# Altium schematic sheet SoC_FPGA_64_65_66_DDR4.SchDoc: RFSoC AMC
size 420 x 297 mm; CompanyName: WUT; DrawnBy: T. Przywozki; Organization: WUT ISE; Address1: Warsaw University of Technology; Address2: Nowowiejska 15/19 00-665 Warsaw; Address3: Tomasz.Przywozki@pw.edu.pl; DocumentNumber: 3; Revision: 1; SheetNumber: 3; SheetTotal: 45; Project: RFSoC AMC; ModifiedBy: T. Przywozki; CreateDate: -; CheckedDate: -; DivGrp: ISE; Designer: T. Przywozki; ModifiedDate: -; ProjectName: ADC/DAC MEZZANINE
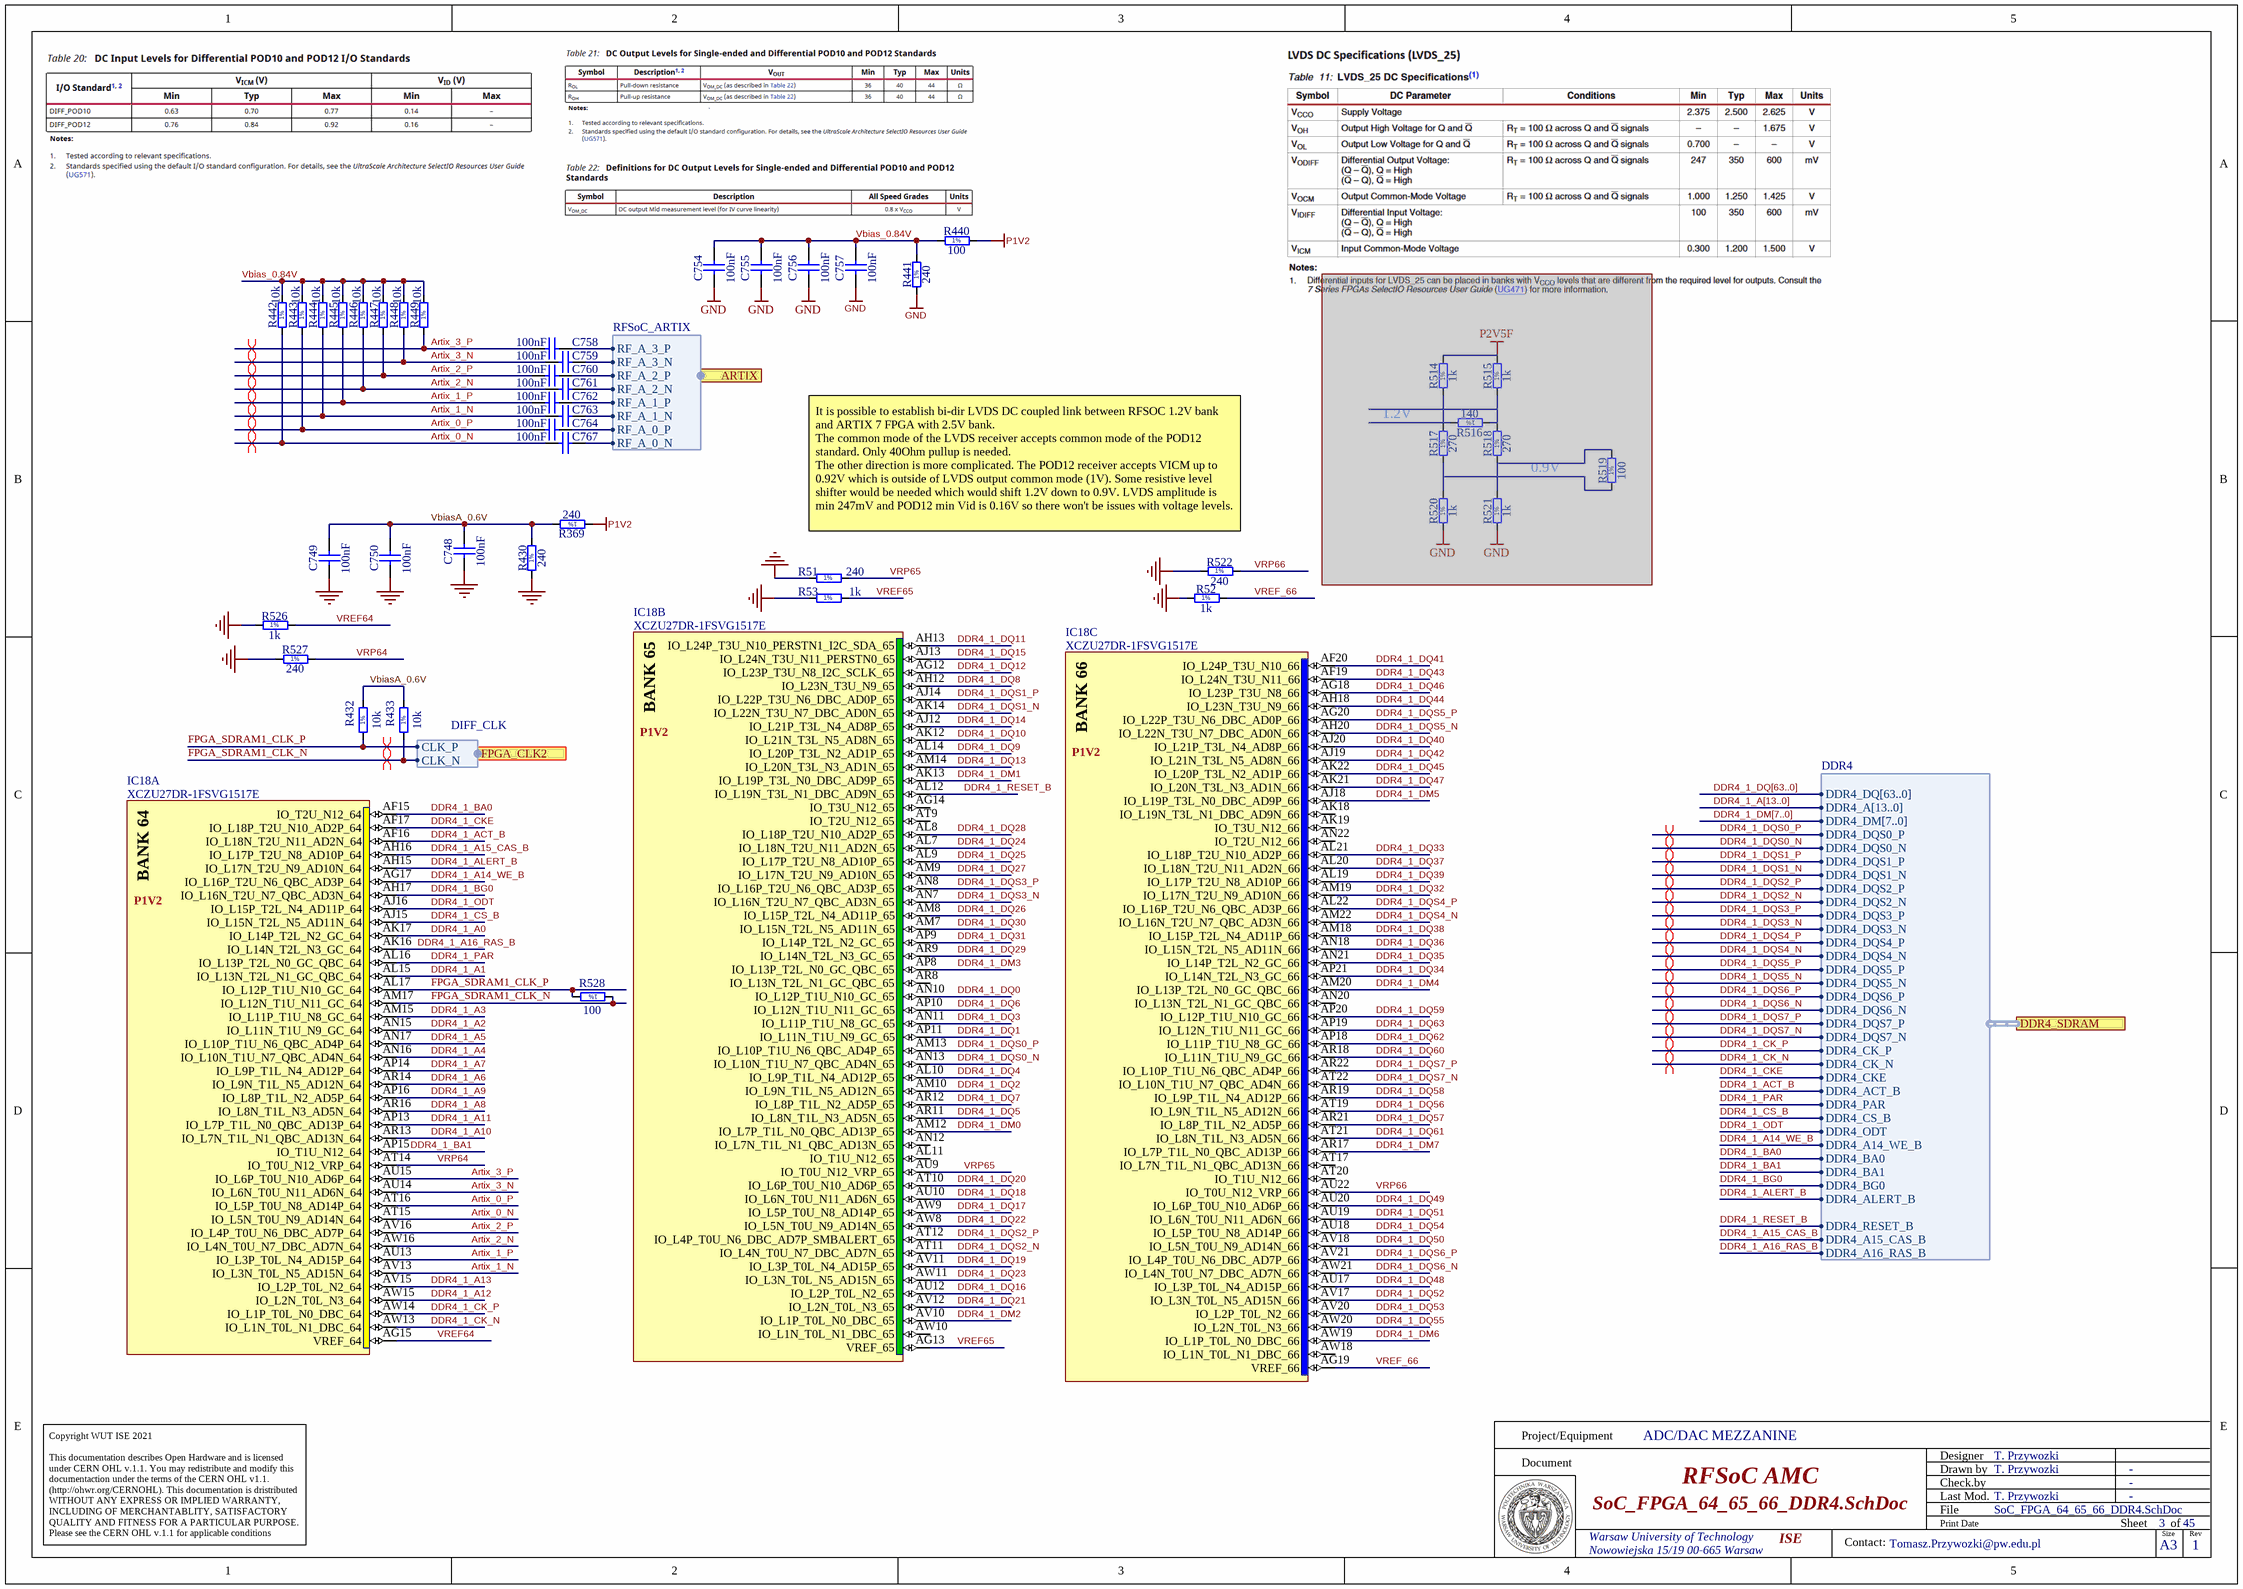
[diagram p0: SoC_FPGA_64_65_66_DDR4.SchDoc]

## Parts
C748  100nF  [CAPC0603X33N]
C749  100nF  [CAPC0603X33N]
C750  100nF  [CAPC0603X33N]
C754  100nF  [CAPC0603X33N]
C755  100nF  [CAPC0603X33N]
C756  100nF  [CAPC0603X33N]
C757  100nF  [CAPC0603X33N]
C758  100nF  [CAPC1005X55N]
C759  100nF  [CAPC1005X55N]
C760  100nF  [CAPC1005X55N]
C761  100nF  [CAPC1005X55N]
C762  100nF  [CAPC1005X55N]
C763  100nF  [CAPC1005X55N]
C764  100nF  [CAPC1005X55N]
C767  100nF  [CAPC1005X55N]
IC18  XCZU27DR-1FSVG1517E  [XILINX_FSVG1517 (XCZU27DR)]  (parts A,B,C of 31)
R51  240  [RESC1005X40N]
R52  1k  [RESC1005X40N]
R53  1k  [RESC1005X40N]
R369  240  [RESC1005X40N]
R430  240  [RESC1005X40N]
R432  10k  [RESC1005X40N]
R433  10k  [RESC1005X40N]
R440  100  [RESC0603X28N]
R441  240  [RESC1005X40N]
R442  10k  [RESC1005X40N]
R443  10k  [RESC1005X40N]
R444  10k  [RESC1005X40N]
R445  10k  [RESC1005X40N]
R446  10k  [RESC1005X40N]
R447  10k  [RESC1005X40N]
R448  10k  [RESC1005X40N]
R449  10k  [RESC1005X40N]
R514  1k  [RESC1005X40N]  (masked out: inside a compile mask, not in the netlist)
R515  1k  [RESC1005X40N]  (masked out: inside a compile mask, not in the netlist)
R516  140  [RESC1005X40N]  (masked out: inside a compile mask, not in the netlist)
R517  270  [RESC1005X40N]  (masked out: inside a compile mask, not in the netlist)
R518  270  [RESC1005X40N]  (masked out: inside a compile mask, not in the netlist)
R519  100  [RESC1005X40N]  (masked out: inside a compile mask, not in the netlist)
R520  1k  [RESC1005X40N]  (masked out: inside a compile mask, not in the netlist)
R521  1k  [RESC1005X40N]  (masked out: inside a compile mask, not in the netlist)
R522  240  [RESC1005X40N]
R526  1k  [RESC1005X40N]
R527  240  [RESC1005X40N]
R528  100  [RESC1005X40N]

## Ports
ARTIX (harness RFSoC_ARTIX), DDR4_SDRAM (harness DDR4), FPGA_CLK2 (out, harness DIFF_CLK)

## Harnesses
DDR4: DDR4_DQ[63..0], DDR4_A[13..0], DDR4_DM[7..0], DDR4_DQS0_P, DDR4_DQS0_N, DDR4_DQS1_P, DDR4_DQS1_N, DDR4_DQS2_P, DDR4_DQS2_N, DDR4_DQS3_P, DDR4_DQS3_N, DDR4_DQS4_P, DDR4_DQS4_N, DDR4_DQS5_P, DDR4_DQS5_N, DDR4_DQS6_P, DDR4_DQS6_N, DDR4_DQS7_P, DDR4_DQS7_N, DDR4_CK_P, DDR4_CK_N, DDR4_CKE, DDR4_ACT_B, DDR4_PAR, DDR4_CS_B, DDR4_ODT, DDR4_A14_WE_B, DDR4_BA0, DDR4_BA1, DDR4_BG0, DDR4_ALERT_B, DDR4_RESET_B, DDR4_A15_CAS_B, DDR4_A16_RAS_B
DIFF_CLK: CLK_P, CLK_N
RFSoC_ARTIX: RF_A_0_N, RF_A_0_P, RF_A_1_N, RF_A_1_P, RF_A_2_N, RF_A_2_P, RF_A_3_N, RF_A_3_P

## Nets
GND: C748.2 C749.2 C750.2 C754.2 C755.2 C756.2 C757.2 R51.1 R52.1 R53.1 R430.1 R441.1 R522.1 R526.1 R527.1
P1V2: R369.1 R440.2
Artix_0_N: C767.1 IC18.AT15(IO_L5N_T0U_N9_AD14N_64) R442.1
Artix_0_P: C764.1 IC18.AT16(IO_L5P_T0U_N8_AD14P_64) R443.1
Artix_1_N: C763.1 IC18.AV13(IO_L3N_T0L_N5_AD15N_64) R444.1
Artix_1_P: C762.1 IC18.AU13(IO_L3P_T0L_N4_AD15P_64) R445.1
Artix_2_N: C761.1 IC18.AW16(IO_L4N_T0U_N7_DBC_AD7N_64) R446.1
Artix_2_P: C760.1 IC18.AV16(IO_L4P_T0U_N6_DBC_AD7P_64) R447.1
Artix_3_N: C759.1 IC18.AU14(IO_L6N_T0U_N11_AD6N_64) R448.1
Artix_3_P: C758.1 IC18.AU15(IO_L6P_T0U_N10_AD6P_64) R449.1
DDR4_1_A0: IC18.AK17(IO_L14P_T2L_N2_GC_64)
DDR4_1_A1: IC18.AL15(IO_L13N_T2L_N1_GC_QBC_64)
DDR4_1_A2: IC18.AN15(IO_L11N_T1U_N9_GC_64)
DDR4_1_A3: IC18.AM15(IO_L11P_T1U_N8_GC_64)
DDR4_1_A4: IC18.AN16(IO_L10N_T1U_N7_QBC_AD4N_64)
DDR4_1_A5: IC18.AN17(IO_L10P_T1U_N6_QBC_AD4P_64)
DDR4_1_A6: IC18.AR14(IO_L9N_T1L_N5_AD12N_64)
DDR4_1_A7: IC18.AP14(IO_L9P_T1L_N4_AD12P_64)
DDR4_1_A8: IC18.AR16(IO_L8N_T1L_N3_AD5N_64)
DDR4_1_A9: IC18.AP16(IO_L8P_T1L_N2_AD5P_64)
DDR4_1_A10: IC18.AR13(IO_L7N_T1L_N1_QBC_AD13N_64)
DDR4_1_A11: IC18.AP13(IO_L7P_T1L_N0_QBC_AD13P_64)
DDR4_1_A12: IC18.AW15(IO_L2N_T0L_N3_64)
DDR4_1_A13: IC18.AV15(IO_L2P_T0L_N2_64)
DDR4_1_A14_WE_B: IC18.AG17(IO_L16P_T2U_N6_QBC_AD3P_64) ; port DDR4_SDRAM.DDR4_A14_WE_B
DDR4_1_A15_CAS_B: IC18.AH16(IO_L17P_T2U_N8_AD10P_64) ; port DDR4_SDRAM.DDR4_A15_CAS_B
DDR4_1_A16_RAS_B: IC18.AK16(IO_L14N_T2L_N3_GC_64) ; port DDR4_SDRAM.DDR4_A16_RAS_B
DDR4_1_ACT_B: IC18.AF16(IO_L18N_T2U_N11_AD2N_64) ; port DDR4_SDRAM.DDR4_ACT_B
DDR4_1_ALERT_B: IC18.AH15(IO_L17N_T2U_N9_AD10N_64) ; port DDR4_SDRAM.DDR4_ALERT_B
DDR4_1_BA0: IC18.AF15(IO_T2U_N12_64) ; port DDR4_SDRAM.DDR4_BA0
DDR4_1_BA1: IC18.AP15(IO_T1U_N12_64) ; port DDR4_SDRAM.DDR4_BA1
DDR4_1_BG0: IC18.AH17(IO_L16N_T2U_N7_QBC_AD3N_64) ; port DDR4_SDRAM.DDR4_BG0
DDR4_1_CK_N: IC18.AW13(IO_L1N_T0L_N1_DBC_64) ; port DDR4_SDRAM.DDR4_CK_N
DDR4_1_CK_P: IC18.AW14(IO_L1P_T0L_N0_DBC_64) ; port DDR4_SDRAM.DDR4_CK_P
DDR4_1_CKE: IC18.AF17(IO_L18P_T2U_N10_AD2P_64) ; port DDR4_SDRAM.DDR4_CKE
DDR4_1_CS_B: IC18.AJ15(IO_L15N_T2L_N5_AD11N_64) ; port DDR4_SDRAM.DDR4_CS_B
DDR4_1_DM0: IC18.AM12(IO_L7P_T1L_N0_QBC_AD13P_65)
DDR4_1_DM1: IC18.AK13(IO_L19P_T3L_N0_DBC_AD9P_65)
DDR4_1_DM2: IC18.AV10(IO_L1P_T0L_N0_DBC_65)
DDR4_1_DM3: IC18.AP8(IO_L13P_T2L_N0_GC_QBC_65)
DDR4_1_DM4: IC18.AM20(IO_L13P_T2L_N0_GC_QBC_66)
DDR4_1_DM5: IC18.AJ18(IO_L19P_T3L_N0_DBC_AD9P_66)
DDR4_1_DM6: IC18.AW19(IO_L1P_T0L_N0_DBC_66)
DDR4_1_DM7: IC18.AR17(IO_L7P_T1L_N0_QBC_AD13P_66)
DDR4_1_DQ0: IC18.AN10(IO_L12P_T1U_N10_GC_65)
DDR4_1_DQ1: IC18.AP11(IO_L11N_T1U_N9_GC_65)
DDR4_1_DQ2: IC18.AM10(IO_L9N_T1L_N5_AD12N_65)
DDR4_1_DQ3: IC18.AN11(IO_L11P_T1U_N8_GC_65)
DDR4_1_DQ4: IC18.AL10(IO_L9P_T1L_N4_AD12P_65)
DDR4_1_DQ5: IC18.AR11(IO_L8N_T1L_N3_AD5N_65)
DDR4_1_DQ6: IC18.AP10(IO_L12N_T1U_N11_GC_65)
DDR4_1_DQ7: IC18.AR12(IO_L8P_T1L_N2_AD5P_65)
DDR4_1_DQ8: IC18.AH12(IO_L23N_T3U_N9_65)
DDR4_1_DQ9: IC18.AL14(IO_L20P_T3L_N2_AD1P_65)
DDR4_1_DQ10: IC18.AK12(IO_L21N_T3L_N5_AD8N_65)
DDR4_1_DQ11: IC18.AH13(IO_L24P_T3U_N10_PERSTN1_I2C_SDA_65)
DDR4_1_DQ12: IC18.AG12(IO_L23P_T3U_N8_I2C_SCLK_65)
DDR4_1_DQ13: IC18.AM14(IO_L20N_T3L_N3_AD1N_65)
DDR4_1_DQ14: IC18.AJ12(IO_L21P_T3L_N4_AD8P_65)
DDR4_1_DQ15: IC18.AJ13(IO_L24N_T3U_N11_PERSTN0_65)
DDR4_1_DQ16: IC18.AU12(IO_L2P_T0L_N2_65)
DDR4_1_DQ17: IC18.AW9(IO_L5P_T0U_N8_AD14P_65)
DDR4_1_DQ18: IC18.AU10(IO_L6N_T0U_N11_AD6N_65)
DDR4_1_DQ19: IC18.AV11(IO_L3P_T0L_N4_AD15P_65)
DDR4_1_DQ20: IC18.AT10(IO_L6P_T0U_N10_AD6P_65)
DDR4_1_DQ21: IC18.AV12(IO_L2N_T0L_N3_65)
DDR4_1_DQ22: IC18.AW8(IO_L5N_T0U_N9_AD14N_65)
DDR4_1_DQ23: IC18.AW11(IO_L3N_T0L_N5_AD15N_65)
DDR4_1_DQ24: IC18.AL7(IO_L18N_T2U_N11_AD2N_65)
DDR4_1_DQ25: IC18.AL9(IO_L17P_T2U_N8_AD10P_65)
DDR4_1_DQ26: IC18.AM8(IO_L15P_T2L_N4_AD11P_65)
DDR4_1_DQ27: IC18.AM9(IO_L17N_T2U_N9_AD10N_65)
DDR4_1_DQ28: IC18.AL8(IO_L18P_T2U_N10_AD2P_65)
DDR4_1_DQ29: IC18.AR9(IO_L14N_T2L_N3_GC_65)
DDR4_1_DQ30: IC18.AM7(IO_L15N_T2L_N5_AD11N_65)
DDR4_1_DQ31: IC18.AP9(IO_L14P_T2L_N2_GC_65)
DDR4_1_DQ32: IC18.AM19(IO_L17N_T2U_N9_AD10N_66)
DDR4_1_DQ33: IC18.AL21(IO_L18P_T2U_N10_AD2P_66)
DDR4_1_DQ34: IC18.AP21(IO_L14N_T2L_N3_GC_66)
DDR4_1_DQ35: IC18.AN21(IO_L14P_T2L_N2_GC_66)
DDR4_1_DQ36: IC18.AN18(IO_L15N_T2L_N5_AD11N_66)
DDR4_1_DQ37: IC18.AL20(IO_L18N_T2U_N11_AD2N_66)
DDR4_1_DQ38: IC18.AM18(IO_L15P_T2L_N4_AD11P_66)
DDR4_1_DQ39: IC18.AL19(IO_L17P_T2U_N8_AD10P_66)
DDR4_1_DQ40: IC18.AJ20(IO_L21P_T3L_N4_AD8P_66)
DDR4_1_DQ41: IC18.AF20(IO_L24P_T3U_N10_66)
DDR4_1_DQ42: IC18.AJ19(IO_L21N_T3L_N5_AD8N_66)
DDR4_1_DQ43: IC18.AF19(IO_L24N_T3U_N11_66)
DDR4_1_DQ44: IC18.AH18(IO_L23N_T3U_N9_66)
DDR4_1_DQ45: IC18.AK22(IO_L20P_T3L_N2_AD1P_66)
DDR4_1_DQ46: IC18.AG18(IO_L23P_T3U_N8_66)
DDR4_1_DQ47: IC18.AK21(IO_L20N_T3L_N3_AD1N_66)
DDR4_1_DQ48: IC18.AU17(IO_L3P_T0L_N4_AD15P_66)
DDR4_1_DQ49: IC18.AU20(IO_L6P_T0U_N10_AD6P_66)
DDR4_1_DQ50: IC18.AV18(IO_L5N_T0U_N9_AD14N_66)
DDR4_1_DQ51: IC18.AU19(IO_L6N_T0U_N11_AD6N_66)
DDR4_1_DQ52: IC18.AV17(IO_L3N_T0L_N5_AD15N_66)
DDR4_1_DQ53: IC18.AV20(IO_L2P_T0L_N2_66)
DDR4_1_DQ54: IC18.AU18(IO_L5P_T0U_N8_AD14P_66)
DDR4_1_DQ55: IC18.AW20(IO_L2N_T0L_N3_66)
DDR4_1_DQ56: IC18.AT19(IO_L9N_T1L_N5_AD12N_66)
DDR4_1_DQ57: IC18.AR21(IO_L8P_T1L_N2_AD5P_66)
DDR4_1_DQ58: IC18.AR19(IO_L9P_T1L_N4_AD12P_66)
DDR4_1_DQ59: IC18.AP20(IO_L12P_T1U_N10_GC_66)
DDR4_1_DQ60: IC18.AR18(IO_L11N_T1U_N9_GC_66)
DDR4_1_DQ61: IC18.AT21(IO_L8N_T1L_N3_AD5N_66)
DDR4_1_DQ62: IC18.AP18(IO_L11P_T1U_N8_GC_66)
DDR4_1_DQ63: IC18.AP19(IO_L12N_T1U_N11_GC_66)
DDR4_1_DQS0_N: IC18.AN13(IO_L10N_T1U_N7_QBC_AD4N_65) ; port DDR4_SDRAM.DDR4_DQS0_N
DDR4_1_DQS0_P: IC18.AM13(IO_L10P_T1U_N6_QBC_AD4P_65) ; port DDR4_SDRAM.DDR4_DQS0_P
DDR4_1_DQS1_N: IC18.AK14(IO_L22N_T3U_N7_DBC_AD0N_65) ; port DDR4_SDRAM.DDR4_DQS1_N
DDR4_1_DQS1_P: IC18.AJ14(IO_L22P_T3U_N6_DBC_AD0P_65) ; port DDR4_SDRAM.DDR4_DQS1_P
DDR4_1_DQS2_N: IC18.AT11(IO_L4N_T0U_N7_DBC_AD7N_65) ; port DDR4_SDRAM.DDR4_DQS2_N
DDR4_1_DQS2_P: IC18.AT12(IO_L4P_T0U_N6_DBC_AD7P_SMBALERT_65) ; port DDR4_SDRAM.DDR4_DQS2_P
DDR4_1_DQS3_N: IC18.AN7(IO_L16N_T2U_N7_QBC_AD3N_65) ; port DDR4_SDRAM.DDR4_DQS3_N
DDR4_1_DQS3_P: IC18.AN8(IO_L16P_T2U_N6_QBC_AD3P_65) ; port DDR4_SDRAM.DDR4_DQS3_P
DDR4_1_DQS4_N: IC18.AM22(IO_L16N_T2U_N7_QBC_AD3N_66) ; port DDR4_SDRAM.DDR4_DQS4_N
DDR4_1_DQS4_P: IC18.AL22(IO_L16P_T2U_N6_QBC_AD3P_66) ; port DDR4_SDRAM.DDR4_DQS4_P
DDR4_1_DQS5_N: IC18.AH20(IO_L22N_T3U_N7_DBC_AD0N_66) ; port DDR4_SDRAM.DDR4_DQS5_N
DDR4_1_DQS5_P: IC18.AG20(IO_L22P_T3U_N6_DBC_AD0P_66) ; port DDR4_SDRAM.DDR4_DQS5_P
DDR4_1_DQS6_N: IC18.AW21(IO_L4N_T0U_N7_DBC_AD7N_66) ; port DDR4_SDRAM.DDR4_DQS6_N
DDR4_1_DQS6_P: IC18.AV21(IO_L4P_T0U_N6_DBC_AD7P_66) ; port DDR4_SDRAM.DDR4_DQS6_P
DDR4_1_DQS7_N: IC18.AT22(IO_L10N_T1U_N7_QBC_AD4N_66) ; port DDR4_SDRAM.DDR4_DQS7_N
DDR4_1_DQS7_P: IC18.AR22(IO_L10P_T1U_N6_QBC_AD4P_66) ; port DDR4_SDRAM.DDR4_DQS7_P
DDR4_1_ODT: IC18.AJ16(IO_L15P_T2L_N4_AD11P_64) ; port DDR4_SDRAM.DDR4_ODT
DDR4_1_PAR: IC18.AL16(IO_L13P_T2L_N0_GC_QBC_64) ; port DDR4_SDRAM.DDR4_PAR
DDR4_1_RESET_B: IC18.AL12(IO_L19N_T3L_N1_DBC_AD9N_65) ; port DDR4_SDRAM.DDR4_RESET_B
FPGA_SDRAM1_CLK_N: IC18.AM17(IO_L12N_T1U_N11_GC_64) R433.1 R528.2 ; port FPGA_CLK2.CLK_N
FPGA_SDRAM1_CLK_P: IC18.AL17(IO_L12P_T1U_N10_GC_64) R432.1 R528.1 ; port FPGA_CLK2.CLK_P
Vbias_0.84V: C754.1 C755.1 C756.1 C757.1 R440.1 R441.2 R442.2 R443.2 R444.2 R445.2 R446.2 R447.2 R448.2 R449.2
VbiasA_0.6V: C748.1 C749.1 C750.1 R369.2 R430.2 R432.2 R433.2
VREF64: IC18.AG15(VREF_64) R526.2
VREF65: IC18.AG13(VREF_65) R53.2
VREF_66: IC18.AG19(VREF_66) R52.2
VRP64: IC18.AT14(IO_T0U_N12_VRP_64) R527.2
VRP65: IC18.AU9(IO_T0U_N12_VRP_65) R51.2
VRP66: IC18.AU22(IO_T0U_N12_VRP_66) R522.2
NetC758_2: C758.2 ; port ARTIX.RF_A_3_P
NetC759_2: C759.2 ; port ARTIX.RF_A_3_N
NetC760_2: C760.2 ; port ARTIX.RF_A_2_P
NetC761_2: C761.2 ; port ARTIX.RF_A_2_N
NetC762_2: C762.2 ; port ARTIX.RF_A_1_P
NetC763_2: C763.2 ; port ARTIX.RF_A_1_N
NetC764_2: C764.2 ; port ARTIX.RF_A_0_P
NetC767_2: C767.2 ; port ARTIX.RF_A_0_N

Not connected (* = marked no-connect by the designer): IC18 AG14(IO_T3U_N12_65) AK18(IO_L19N_T3L_N1_DBC_AD9N_66) AK19(IO_T3U_N12_66) AL11(IO_T1U_N12_65) AN12(IO_L7N_T1L_N1_QBC_AD13N_65) AN20(IO_L13N_T2L_N1_GC_QBC_66) AN22(IO_T2U_N12_66) AR8(IO_L13N_T2L_N1_GC_QBC_65) AT9(IO_T2U_N12_65) AT17(IO_L7N_T1L_N1_QBC_AD13N_66) AT20(IO_T1U_N12_66) AW10(IO_L1N_T0L_N1_DBC_65) AW18(IO_L1N_T0L_N1_DBC_66)

## Buses and harness runs
bus DDR4_1_A[13..0]
bus DDR4_1_DM[7..0]
bus DDR4_1_DQ[63..0]

## Layout directives
differential pair: Artix_0_N, Artix_0_P, Artix_1_N, Artix_1_P, Artix_2_N, Artix_2_P, Artix_3_N, Artix_3_P, DDR4_1_CK_N, DDR4_1_CK_P, DDR4_1_DQS0_N, DDR4_1_DQS0_P, DDR4_1_DQS1_N, DDR4_1_DQS1_P, DDR4_1_DQS2_N, DDR4_1_DQS2_P, DDR4_1_DQS3_N, DDR4_1_DQS3_P, DDR4_1_DQS4_N, DDR4_1_DQS4_P, DDR4_1_DQS5_N, DDR4_1_DQS5_P, DDR4_1_DQS6_N, DDR4_1_DQS6_P, DDR4_1_DQS7_N, DDR4_1_DQS7_P, FPGA_SDRAM1_CLK_N, FPGA_SDRAM1_CLK_P

## Notes on the sheet
- 1.2V
- It is possible to establish bi-dir LVDS DC coupled link between RFSOC 1.2V bank and ARTIX 7 FPGA with 2.5V bank.
  The common mode of the LVDS receiver accepts common mode of the POD12 standard. Only 40Ohm pullup is needed.
  The other direction is more complicated. The POD12 receiver accepts VICM up to 0.92V which is outside of LVDS output common mode (1V). Some resistive level shifter would be needed which would shift 1.2V down to 0.9V. LVDS amplitude is min 247mV and POD12 min Vid is 0.16V so there won't be issues with voltage levels.
- 0.9V
- P1V2
- Project/Equipment
- Document
- Designer
- Drawn by
- Check.by
- Copyright WUT ISE 2021
  This documentation describes Open Hardware and is licensed under CERN OHL v.1.1. You may redistribute and modify this documentaction under the terms of the CERN OHL v1.1.
  (http://ohwr.org/CERNOHL). This documentation is dristributed WITHOUT ANY EXPRESS OR IMPLIED WARRANTY, INCLUDING OF MERCHANTABLITY, SATISFACTORY QUALITY AND FITNESS FOR A PARTICULAR PURPOSE. Please see the CERN OHL v.1.1 for applicable conditions
- File
- Last Mod.
- Print Date
- Sheet
- Size
- A3
- of
- Rev
- Contact:
- (in symbol R0201_100R_1%_0.05W_200PPM) 1%
- (in symbol R0402_1K_1%_0.0625W_100PPM) 1%
- (in symbol R0402_10K_1%_0.0625W_100PPM) 1%
- (in symbol R0402_100R_1%_0.0625W_100PPM) 1%
- (in symbol R0402_140R_1%_0.0625W_100PPM) 1%
- (in symbol R0402_240R_1%_0.0625W_100PPM) 1%
- (in symbol R0402_270R_1%_0.0625W_100PPM) 1%
- (in symbol XCZU27DR-1FSVG1517E, part A) BANK 64
- (in symbol XCZU27DR-1FSVG1517E, part B) BANK 65
- (in symbol XCZU27DR-1FSVG1517E, part C) BANK 66

## Library data of the parts
C748-C750 = CC0201_100NF_6.3V_10%_X5R: Non-polarised capacitor; Manufacturer: GENERIC; Part Description: SMD Multilayer Chip Ceramic Capacitor; Manufacturer1 Part Number: 02016D104KAT2A; Tolerance: ±10%; Voltage: 6.3V; TC: X5R; Manufacturer Part Number: CC0201_100NF_6.3V_10%_X5R; Part Number: CC0201_100NF_6.3V_10%_X5R; Value: 100nF; Component Kind: Standard; Component Type: Standard; Pin Count: 2; Status: Not Recommended; Case: 0201; Mounted: Yes; Socket: No; SMD: Yes; Sense: No; Manufacturer1 Example: AVX; Manufacturer1 ComponentHeight: 0.33mm; HelpURL: \\cern.ch\dfs\Applications\Altium\Datasheets\CC0201_X5R_AVX.pdf; Author: CERN DEM JLC; CreateDate: 03.12.2007; LatestRevisionDate: 03.12.2007
C754-C757 = CC0201_100NF_6.3V_10%_X5R: Non-polarised capacitor; Manufacturer: GENERIC; Manufacturer1 Part Number: 02016D104KAT2A; Part Description: SMD Multilayer Chip Ceramic Capacitor; TC: X5R; Tolerance: ±10%; Voltage: 6.3V; Case: 0201; Manufacturer Part Number: CC0201_100NF_6.3V_10%_X5R; Manufacturer1 Example: AVX; Part Number: CC0201_100NF_6.3V_10%_X5R; Pin Count: 2; SMD: Yes; Status: Not Recommended; Value: 100nF; Component Kind: Standard; Component Type: Standard; Mounted: Yes; Socket: No; Sense: No; Manufacturer1 ComponentHeight: 0.33mm; HelpURL: \\cern.ch\dfs\Applications\Altium\Datasheets\CC0201_X5R_AVX.pdf; Author: CERN DEM JLC; CreateDate: 03.12.2007; LatestRevisionDate: 03.12.2007
C758-C764 C767 = CC0402_100NF_16V_10%_X5R: Non-polarised capacitor; Manufacturer: GENERIC; Manufacturer1 Part Number: GRM155R61C104KA88D; Part Description: SMD Multilayer Chip Ceramic Capacitor; TC: X5R; Tolerance: ±10%; Voltage: 16V; Case: 0402; Manufacturer Part Number: CC0402_100NF_16V_10%_X5R; Manufacturer1 Example: MURATA; Part Number: CC0402_100NF_16V_10%_X5R; Pin Count: 2; SMD: Yes; Status: None; Value: 100nF; Component Kind: Standard; Component Type: Standard; Mounted: Yes; Socket: No; Sense: No; Manufacturer1 ComponentHeight: 0.55mm; HelpURL: \\cern.ch\dfs\Applications\Altium\Datasheets\CC0402_X5R_MURATA_GRM.pdf; Author: CERN DEM JLC; CreateDate: 10.12.2013; LatestRevisionDate: 10.12.2013
IC18 = XCZU27DR-1FSVG1517E: Zynq UltraScale+ RFSoC, Quad-Core ARM® Cortex™-A53 MPCore™ up to 1.5GHz, 214 PS I/O, 299 HP I/O, 48 HD I/O, 1517-Pin BGA; Manufacturer: XILINX; PressFit: No; Bonding: No; Part Number: XCZU27DR-1FSVG1517E; Component Kind: Standard; Component Type: Standard; Device: XCZU27DR-1FSVG1517E; PackageDescription: BGA, 1.00mm Pitch, Square; 1517 Pin, 39 Columns X 39 Rows, 40.00mm X 40.00mm X 4.01mm H; Part Description: Zynq UltraScale+ RFSoC, Quad-Core ARM® Cortex™-A53 MPCore™ up to 1.5GHz, 214 PS I/O, 299 HP I/O, 48 HD I/O, 1517-Pin BGA; Manufacturer Part Number: XCZU27DR-1FSVG1517E; Pin Count: 1517; Case: BGA1517; Mounted: Yes; Socket: No; SMD: Yes; Sense: No; ComponentHeight: 4.01mm; HelpURL: \\cern.ch\dfs\Applications\Altium\Datasheets\XCZU27DR-1FSVG1517E.pdf; ComponentLink1URL: \\cern.ch\dfs\Applications\Altium\Datasheets\XCZU27DR-1FSVG1517E_Package-Pinout.pdf; ComponentLink1Description: Package/Pinout; ComponentLink2URL: \\cern.ch\dfs\Applications\Altium\Datasheets\XCZU27DR-1FSVG1517E_Pinout.pdf; ComponentLink2Description: Pinout; Author: CERN DEM MR; CreateDate: 02/05/2018; LatestRevisionDate: 02/05/2018
R51 R369 R430 R522 R527 = R0402_240R_1%_0.0625W_100PPM: Resistor - 1%; Manufacturer: GENERIC; Part Description: General Purpose Thick Film Chip Resistor; Manufacturer1 Part Number: 232270672401L; TC: ±100ppm/°C; PressFit: No; Manufacturer Part Number: R0402_240R_1%_0.0625W_100PPM; Part Number: R0402_240R_1%_0.0625W_100PPM; Tolerance: ±1%; Value: 240; Component Kind: Standard; Component Type: Standard; Pin Count: 2; Status: Not Recommended; Power: 0.0625W; Case: 0402; Mounted: Yes; Sense: No; Socket: No; SMD: Yes; Manufacturer1 Example: YAGEO PHYCOMP; Manufacturer1 ComponentHeight: 0.4mm; HelpURL: \\cern.ch\dfs\Applications\Altium\Datasheets\R0402_Phycomp_RC0402.pdf; Author: CERN DEM JLC; CreateDate: 03.12.2007; LatestRevisionDate: 17.10.2012
R52 R53 R526 = R0402_1K_1%_0.0625W_100PPM: Resistor - 1%; Manufacturer: GENERIC; Part Description: General Purpose Thick Film Chip Resistor; Manufacturer1 Part Number: 232270671002L; TC: ±100ppm/°C; PressFit: No; Manufacturer Part Number: R0402_1K_1%_0.0625W_100PPM; Part Number: R0402_1K_1%_0.0625W_100PPM; Tolerance: ±1%; Value: 1k; Component Kind: Standard; Component Type: Standard; Pin Count: 2; Status: Not Recommended; Power: 0.0625W; Case: 0402; Mounted: Yes; Sense: No; Socket: No; SMD: Yes; Manufacturer1 Example: YAGEO PHYCOMP; Manufacturer1 ComponentHeight: 0.4mm; HelpURL: \\cern.ch\dfs\Applications\Altium\Datasheets\R0402_Phycomp_RC0402.pdf; Author: CERN DEM JLC; CreateDate: 03.12.2007; LatestRevisionDate: 17.10.2012
R432 R433 = R0402_10K_1%_0.0625W_100PPM: Resistor - 1%; Manufacturer: GENERIC; Part Description: General Purpose Thick Film Chip Resistor; Manufacturer1 Part Number: 232270671003L; TC: ±100ppm/°C; PressFit: No; Manufacturer Part Number: R0402_10K_1%_0.0625W_100PPM; Part Number: R0402_10K_1%_0.0625W_100PPM; Tolerance: ±1%; Value: 10k; Component Kind: Standard; Component Type: Standard; Pin Count: 2; Status: Not Recommended; Power: 0.0625W; Case: 0402; Mounted: Yes; Sense: No; Socket: No; SMD: Yes; Manufacturer1 Example: YAGEO PHYCOMP; Manufacturer1 ComponentHeight: 0.4mm; HelpURL: \\cern.ch\dfs\Applications\Altium\Datasheets\R0402_Phycomp_RC0402.pdf; Author: CERN DEM JLC; CreateDate: 03.12.2007; LatestRevisionDate: 17.10.2012
R440 = R0201_100R_1%_0.05W_200PPM: Resistor - 1%; Part Description: Thick Film Chip Resistor; Manufacturer: GENERIC; Manufacturer1 Part Number: CRCW0201100RFNED; Power: 0.05W; TC: ±200ppm/°C; PressFit: No; Part Number: R0201_100R_1%_0.05W_200PPM; Component Kind: Standard; Component Type: Standard; Pin Count: 2; Value: 100; Status: Not Recommended; Tolerance: ±1%; Manufacturer Part Number: R0201_100R_1%_0.05W_200PPM; Case: 0201; Mounted: Yes; Sense: No; Socket: No; SMD: Yes; Manufacturer1 Example: VISHAY; Manufacturer1 ComponentHeight: 0.27mm; HelpURL: \\cern.ch\dfs\Applications\Altium\Datasheets\R0201_VISHAY_CRCW e3.pdf; Author: CERN DEM JLC; CreateDate: 13.11.2014; LatestRevisionDate: 13.11.2014
R441 = R0402_240R_1%_0.0625W_100PPM: Resistor - 1%; Manufacturer: GENERIC; Manufacturer1 Part Number: 232270672401L; Part Description: General Purpose Thick Film Chip Resistor; TC: ±100ppm/°C; PressFit: No; Case: 0402; Manufacturer Part Number: R0402_240R_1%_0.0625W_100PPM; Manufacturer1 ComponentHeight: 0.4mm; Manufacturer1 Example: YAGEO PHYCOMP; Part Number: R0402_240R_1%_0.0625W_100PPM; Pin Count: 2; Power: 0.0625W; Sense: No; SMD: Yes; Status: Not Recommended; Tolerance: ±1%; Value: 240; Component Kind: Standard; Component Type: Standard; Mounted: Yes; Socket: No; HelpURL: \\cern.ch\dfs\Applications\Altium\Datasheets\R0402_Phycomp_RC0402.pdf; Author: CERN DEM JLC; CreateDate: 03.12.2007; LatestRevisionDate: 17.10.2012
R442-R449 = R0402_10K_1%_0.0625W_100PPM: Resistor - 1%; Manufacturer: GENERIC; Manufacturer1 Part Number: 232270671003L; Part Description: General Purpose Thick Film Chip Resistor; PressFit: No; TC: ±100ppm/°C; Author: CERN DEM JLC; Case: 0402; Component Kind: Standard; Component Type: Standard; CreateDate: 03.12.2007; HelpURL: \\cern.ch\dfs\Applications\Altium\Datasheets\R0402_Phycomp_RC0402.pdf; LatestRevisionDate: 17.10.2012; Manufacturer Part Number: R0402_10K_1%_0.0625W_100PPM; Manufacturer1 ComponentHeight: 0.4mm; Manufacturer1 Example: YAGEO PHYCOMP; Mounted: Yes; Part Number: R0402_10K_1%_0.0625W_100PPM; Pin Count: 2; Power: 0.0625W; Sense: No; SMD: Yes; Socket: No; Status: Not Recommended; Tolerance: ±1%; Value: 10k
R514 R515 R520 R521 = R0402_1K_1%_0.0625W_100PPM: Resistor - 1%; Part Description: General Purpose Thick Film Chip Resistor; Manufacturer: GENERIC; Manufacturer1 Part Number: 232270671002L; TC: ±100ppm/°C; PressFit: No; Part Number: R0402_1K_1%_0.0625W_100PPM; Component Kind: Standard; Component Type: Standard; Pin Count: 2; Value: 1k; Status: Not Recommended; Power: 0.0625W; Tolerance: ±1%; Manufacturer Part Number: R0402_1K_1%_0.0625W_100PPM; Case: 0402; Mounted: Yes; Sense: No; Socket: No; SMD: Yes; Manufacturer1 Example: YAGEO PHYCOMP; Manufacturer1 ComponentHeight: 0.4mm; HelpURL: \\cern.ch\dfs\Applications\Altium\Datasheets\R0402_Phycomp_RC0402.pdf; Author: CERN DEM JLC; CreateDate: 03/12/2007; LatestRevisionDate: 17/10/2012
R516 = R0402_140R_1%_0.0625W_100PPM: Resistor - 1%; Part Description: General Purpose Thick Film Chip Resistor; Manufacturer: GENERIC; Manufacturer1 Part Number: 232270671401L or RC0402FR-07140RL; TC: ±100ppm/°C; PressFit: No; Part Number: R0402_140R_1%_0.0625W_100PPM; Component Kind: Standard; Component Type: Standard; Pin Count: 2; Value: 140; Status: Not Recommended; Power: 0.0625W; Tolerance: ±1%; Manufacturer Part Number: R0402_140R_1%_0.0625W_100PPM; Case: 0402; Mounted: Yes; Sense: No; Socket: No; SMD: Yes; Manufacturer1 Example: YAGEO PHYCOMP; Manufacturer1 ComponentHeight: 0.4mm; HelpURL: \\cern.ch\dfs\Applications\Altium\Datasheets\R0402_Phycomp_RC0402.pdf; Author: CERN DEM BC; CreateDate: 29/07/2015; LatestRevisionDate: 29/07/2015
R517 R518 = R0402_270R_1%_0.0625W_100PPM: Resistor - 1%; Part Description: General Purpose Thick Film Chip Resistor; Manufacturer: GENERIC; Manufacturer1 Part Number: 232270672701L; TC: ±100ppm/°C; PressFit: No; Part Number: R0402_270R_1%_0.0625W_100PPM; Component Kind: Standard; Component Type: Standard; Pin Count: 2; Value: 270; Status: Not Recommended; Power: 0.0625W; Tolerance: ±1%; Manufacturer Part Number: R0402_270R_1%_0.0625W_100PPM; Case: 0402; Mounted: Yes; Sense: No; Socket: No; SMD: Yes; Manufacturer1 Example: YAGEO PHYCOMP; Manufacturer1 ComponentHeight: 0.4mm; HelpURL: \\cern.ch\dfs\Applications\Altium\Datasheets\R0402_Phycomp_RC0402.pdf; Author: CERN DEM JLC; CreateDate: 03/12/2007; LatestRevisionDate: 17/10/2012
R519 = R0402_100R_1%_0.0625W_100PPM: Resistor - 1%; Part Description: General Purpose Thick Film Chip Resistor; Manufacturer: GENERIC; Manufacturer1 Part Number: 232270671001L; TC: ±100ppm/°C; PressFit: No; Part Number: R0402_100R_1%_0.0625W_100PPM; Component Kind: Standard; Component Type: Standard; Pin Count: 2; Value: 100; Status: Not Recommended; Power: 0.0625W; Tolerance: ±1%; Manufacturer Part Number: R0402_100R_1%_0.0625W_100PPM; Case: 0402; Mounted: Yes; Sense: No; Socket: No; SMD: Yes; Manufacturer1 Example: YAGEO PHYCOMP; Manufacturer1 ComponentHeight: 0.4mm; HelpURL: \\cern.ch\dfs\Applications\Altium\Datasheets\R0402_Phycomp_RC0402.pdf; Author: CERN DEM JLC; CreateDate: 03/12/2007; LatestRevisionDate: 17/10/2012
R528 = R0402_100R_1%_0.0625W_100PPM: Resistor - 1%; Manufacturer: GENERIC; Part Description: General Purpose Thick Film Chip Resistor; Manufacturer1 Part Number: 232270671001L; TC: ±100ppm/°C; PressFit: No; Manufacturer Part Number: R0402_100R_1%_0.0625W_100PPM; Part Number: R0402_100R_1%_0.0625W_100PPM; Tolerance: ±1%; Value: 100; Component Kind: Standard; Component Type: Standard; Pin Count: 2; Status: Not Recommended; Power: 0.0625W; Case: 0402; Mounted: Yes; Sense: No; Socket: No; SMD: Yes; Manufacturer1 Example: YAGEO PHYCOMP; Manufacturer1 ComponentHeight: 0.4mm; HelpURL: \\cern.ch\dfs\Applications\Altium\Datasheets\R0402_Phycomp_RC0402.pdf; Author: CERN DEM JLC; CreateDate: 03/12/2007; LatestRevisionDate: 17/10/2012